# Altium schematic sheet PCB_Altium.schdoc
size 308 x 185 mm
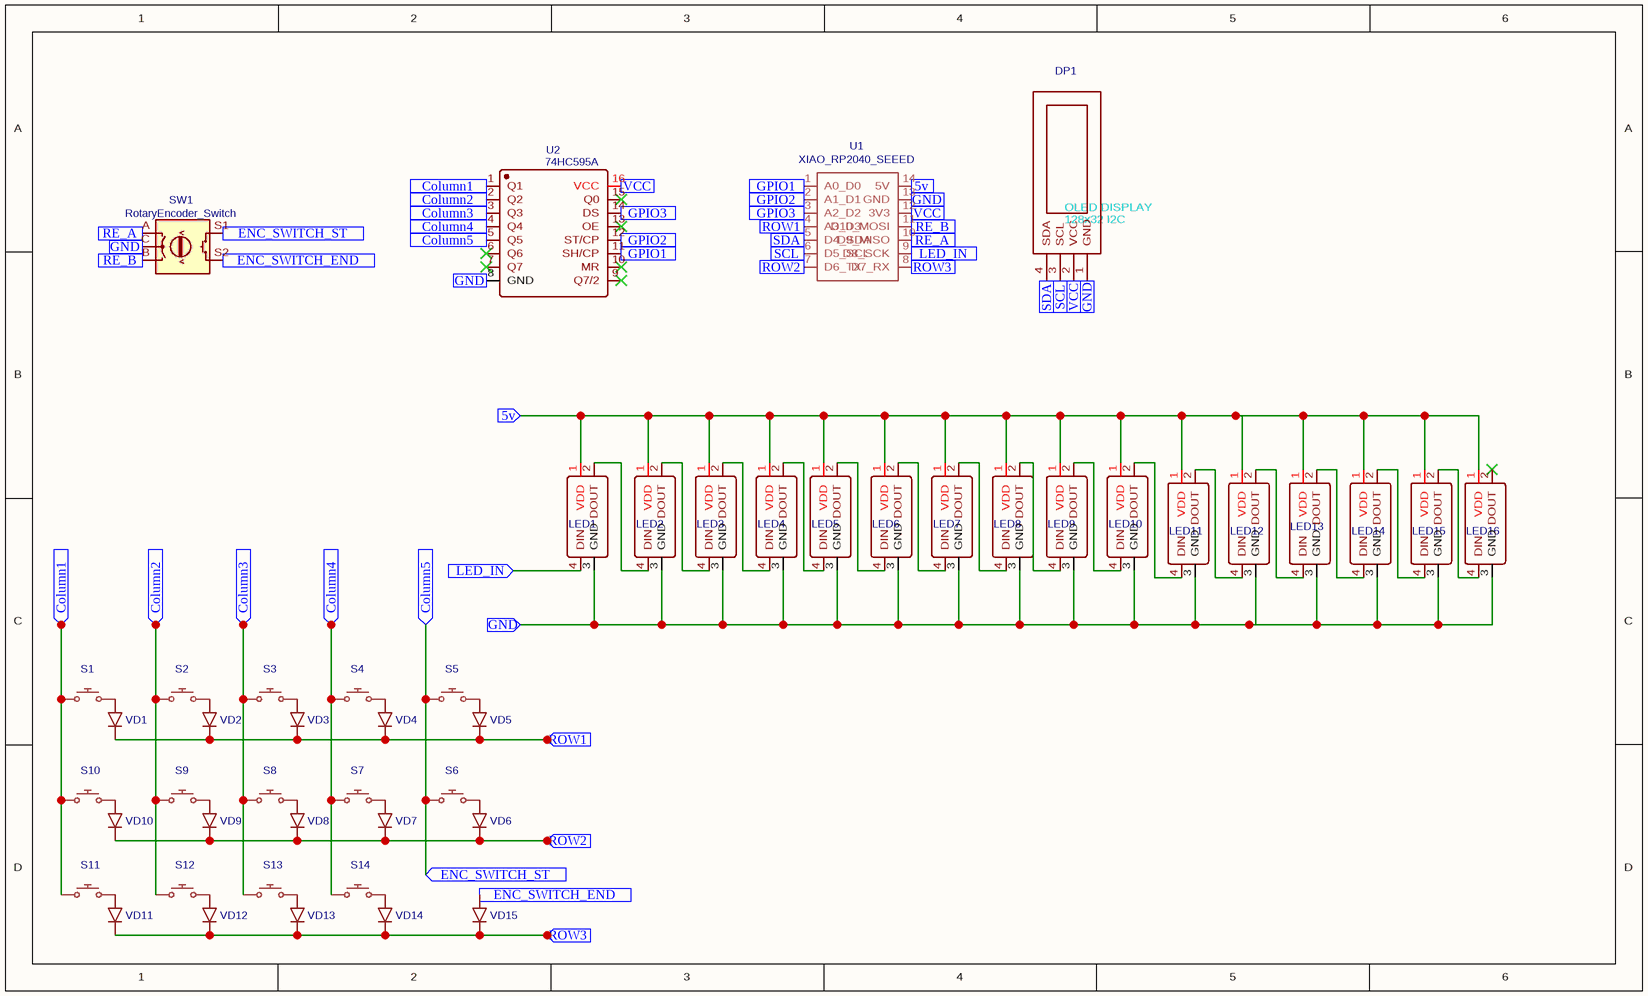
[diagram p0: PCB_Altium.schdoc]

## Parts
DP1  OLED DISPLAY 128x32 0.91" I2C SSD1306 STAG5  [4PIN-CONNECTION]  (value not drawn)
LED1  SK6812MINI-EA  [LED-SMD_4P-L3.2-W2.8_SK6812MINI-EA]  (value not drawn)
LED2  SK6812MINI-EA  [LED-SMD_4P-L3.2-W2.8_SK6812MINI-EA]  (value not drawn)
LED3  SK6812MINI-EA  [LED-SMD_4P-L3.2-W2.8_SK6812MINI-EA]  (value not drawn)
LED4  SK6812MINI-EA  [LED-SMD_4P-L3.2-W2.8_SK6812MINI-EA]  (value not drawn)
LED5  SK6812MINI-EA  [LED-SMD_4P-L3.2-W2.8_SK6812MINI-EA]  (value not drawn)
LED6  SK6812MINI-EA  [LED-SMD_4P-L3.2-W2.8_SK6812MINI-EA]  (value not drawn)
LED7  SK6812MINI-EA  [LED-SMD_4P-L3.2-W2.8_SK6812MINI-EA]  (value not drawn)
LED8  SK6812MINI-EA  [LED-SMD_4P-L3.2-W2.8_SK6812MINI-EA]  (value not drawn)
LED9  SK6812MINI-EA  [LED-SMD_4P-L3.2-W2.8_SK6812MINI-EA]  (value not drawn)
LED10  SK6812MINI-EA  [LED-SMD_4P-L3.2-W2.8_SK6812MINI-EA]  (value not drawn)
LED11  SK6812MINI-EA  [LED-SMD_4P-L3.2-W2.8_SK6812MINI-EA]  (value not drawn)
LED12  SK6812MINI-EA  [LED-SMD_4P-L3.2-W2.8_SK6812MINI-EA]  (value not drawn)
LED13  SK6812MINI-EA  [LED-SMD_4P-L3.2-W2.8_SK6812MINI-EA]  (value not drawn)
LED14  SK6812MINI-EA  [LED-SMD_4P-L3.2-W2.8_SK6812MINI-EA]  (value not drawn)
LED15  SK6812MINI-EA  [LED-SMD_4P-L3.2-W2.8_SK6812MINI-EA]  (value not drawn)
LED16  SK6812MINI-EA  [LED-SMD_4P-L3.2-W2.8_SK6812MINI-EA]  (value not drawn)
S1  CHERRY_CHERRY_MX  [CHERRY_MX]  (value not drawn)
S2  CHERRY_CHERRY_MX  [CHERRY_MX]  (value not drawn)
S3  CHERRY_CHERRY_MX  [CHERRY_MX]  (value not drawn)
S4  CHERRY_CHERRY_MX  [CHERRY_MX]  (value not drawn)
S5  CHERRY_CHERRY_MX  [CHERRY_MX]  (value not drawn)
S6  CHERRY_CHERRY_MX  [CHERRY_MX]  (value not drawn)
S7  CHERRY_CHERRY_MX  [CHERRY_MX]  (value not drawn)
S8  CHERRY_CHERRY_MX  [CHERRY_MX]  (value not drawn)
S9  CHERRY_CHERRY_MX  [CHERRY_MX]  (value not drawn)
S10  CHERRY_CHERRY_MX  [CHERRY_MX]  (value not drawn)
S11  CHERRY_CHERRY_MX  [CHERRY_MX]  (value not drawn)
S12  CHERRY_CHERRY_MX  [CHERRY_MX]  (value not drawn)
S13  CHERRY_CHERRY_MX  [CHERRY_MX]  (value not drawn)
S14  CHERRY_CHERRY_MX  [CHERRY_MX]  (value not drawn)
SW1  RotaryEncoder_Switch  [ROTARYENCODER_ALPS_EC11E-SWITCH_VERTICAL_H20MM]
U1  XIAO_RP2040_SEEED  [XIAO_RP2040_SEEED]
U2  74HC595A  [74HC595]
VD1  1N4148  [1N4148_1N4148W]  (value not drawn)
VD2  1N4148  [1N4148_1N4148W]  (value not drawn)
VD3  1N4148  [1N4148_1N4148W]  (value not drawn)
VD4  1N4148  [1N4148_1N4148W]  (value not drawn)
VD5  1N4148  [1N4148_1N4148W]  (value not drawn)
VD6  1N4148  [1N4148_1N4148W]  (value not drawn)
VD7  1N4148  [1N4148_1N4148W]  (value not drawn)
VD8  1N4148  [1N4148_1N4148W]  (value not drawn)
VD9  1N4148  [1N4148_1N4148W]  (value not drawn)
VD10  1N4148  [1N4148_1N4148W]  (value not drawn)
VD11  1N4148  [1N4148_1N4148W]  (value not drawn)
VD12  1N4148  [1N4148_1N4148W]  (value not drawn)
VD13  1N4148  [1N4148_1N4148W]  (value not drawn)
VD14  1N4148  [1N4148_1N4148W]  (value not drawn)
VD15  1N4148  [1N4148_1N4148W]  (value not drawn)

## Ports
5v (in), Column1 (in), Column2 (in), Column3 (in), Column4 (in), Column5 (in), ENC_SWITCH_END (in), ENC_SWITCH_ST (in), GND (in), GPIO1 (in), GPIO2 (in), GPIO3 (in), LED_IN (in), RE_A (in), RE_B (in), ROW1 (in), ROW2 (in), ROW3 (in), SCL (in), SDA (in), VCC (in)

## Nets
5v: LED1.1(VDD) LED2.1(VDD) LED3.1(VDD) LED4.1(VDD) LED5.1(VDD) LED6.1(VDD) LED7.1(VDD) LED8.1(VDD) LED9.1(VDD) LED10.1(VDD) LED11.1(VDD) LED12.1(VDD) LED13.1(VDD) LED14.1(VDD) LED15.1(VDD) LED16.1(VDD) U1.14(5V) ; port 5v
Column1: S1.S1 S10.S1 S11.S1 U2.1(Q1) ; port Column1
Column2: S2.S1 S9.S1 S12.S1 U2.2(Q2) ; port Column2
Column3: S3.S1 S8.S1 S13.S1 U2.3(Q3) ; port Column3
Column4: S4.S1 S7.S1 S14.S1 U2.4(Q4) ; port Column4
Column5: S5.S1 S6.S1 SW1.S1 U2.5(Q5) ; port ENC_SWITCH_ST, port Column5
ENC_SWITCH_END: SW1.S2 VD15.2 ; port ENC_SWITCH_END
GND: DP1.1(GND) LED1.3(GND) LED2.3(GND) LED3.3(GND) LED4.3(GND) LED5.3(GND) LED6.3(GND) LED7.3(GND) LED8.3(GND) LED9.3(GND) LED10.3(GND) LED11.3(GND) LED12.3(GND) LED13.3(GND) LED14.3(GND) LED15.3(GND) LED16.3(GND) SW1.C U1.13(GND) U2.8(GND) ; port GND
GPIO1: U1.1(A0_D0) U2.11(SH/CP) ; port GPIO1
GPIO2: U1.2(A1_D1) U2.12(ST/CP) ; port GPIO2
GPIO3: U1.3(A2_D2) U2.14(DS) ; port GPIO3
LED_IN: LED1.4(DIN) U1.9(D8_SCK) ; port LED_IN
RE_A: SW1.A U1.10(D9_MISO) ; port RE_A
RE_B: SW1.B U1.11(D10_MOSI) ; port RE_B
ROW1: U1.4(A3_D3) VD1.1 VD2.1 VD3.1 VD4.1 VD5.1 ; port ROW1
ROW2: U1.7(D6_TX) VD6.1 VD7.1 VD8.1 VD9.1 VD10.1 ; port ROW2
ROW3: U1.8(D7_RX) VD11.1 VD12.1 VD13.1 VD14.1 VD15.1 ; port ROW3
SCL: DP1.3(SCL) U1.6(D5_SCL) ; port SCL
SDA: DP1.4(SDA) U1.5(D4_SDA) ; port SDA
VCC: DP1.2(VCC) U1.12(3V3) U2.16(VCC) ; port VCC
NetLED1_2: LED1.2(DOUT) LED2.4(DIN)
NetLED2_2: LED2.2(DOUT) LED3.4(DIN)
NetLED3_2: LED3.2(DOUT) LED4.4(DIN)
NetLED4_2: LED4.2(DOUT) LED5.4(DIN)
NetLED5_2: LED5.2(DOUT) LED6.4(DIN)
NetLED6_2: LED6.2(DOUT) LED7.4(DIN)
NetLED7_2: LED7.2(DOUT) LED8.4(DIN)
NetLED8_2: LED8.2(DOUT) LED9.4(DIN)
NetLED9_2: LED9.2(DOUT) LED10.4(DIN)
NetLED10_2: LED10.2(DOUT) LED11.4(DIN)
NetLED11_2: LED11.2(DOUT) LED12.4(DIN)
NetLED12_2: LED12.2(DOUT) LED13.4(DIN)
NetLED13_2: LED13.2(DOUT) LED14.4(DIN)
NetLED14_2: LED14.2(DOUT) LED15.4(DIN)
NetLED15_2: LED15.2(DOUT) LED16.4(DIN)
NetS1_S2: S1.S2 VD1.2
NetS2_S2: S2.S2 VD2.2
NetS3_S2: S3.S2 VD3.2
NetS4_S2: S4.S2 VD4.2
NetS5_S2: S5.S2 VD5.2
NetS6_S2: S6.S2 VD6.2
NetS7_S2: S7.S2 VD7.2
NetS8_S2: S8.S2 VD8.2
NetS9_S2: S9.S2 VD9.2
NetS10_S2: S10.S2 VD10.2
NetS11_S2: S11.S2 VD11.2
NetS12_S2: S12.S2 VD12.2
NetS13_S2: S13.S2 VD13.2
NetS14_S2: S14.S2 VD14.2

Not connected (* = marked no-connect by the designer): LED16 2(DOUT)*; U2 6(Q6)* 7(Q7)* 9(Q7/2)* 10(MR)* 13(OE)* 15(Q0)*

## Notes on the sheet
- (near LED13) LED13
- (in symbol OLED DISPLAY 128x32 0.91" I2C SSD1306 STAG5) OLED DISPLAY / 128x32 I2C

## Library data of the parts
DP1 = OLED DISPLAY 128x32 0.91" I2C SSD1306 STAG5: Contributor: Saber T; spicePre: D; spiceSymbolName: OLED DISPLAY 128x32 0.91" I2C SSD1306 STAG5
LED1-LED16 = SK6812MINI-EA: Manufacturer: 欧思科光电; Contributor: lcsc; Supplier: LCSC; Supplier Part: C5378731; Manufacturer Part: SK6812MINI-EA; JLCPCB Part Class: Extended Part; spicePre: L; spiceSymbolName: SK6812MINI-EA
S1-S14 = CHERRY_CHERRY_MX: Contributor: paillechat; Package Display: No; spicePre: S; spiceSymbolName: CHERRY_CHERRY_MX
SW1 = RotaryEncoder_Switch: Contributor: chris1414; Footprint: Rotary_Encoder:RotaryEncoder_Alps_EC11E-Switch_Vertical_H20mm; spicePre: S; spiceSymbolName: RotaryEncoder_Switch
U1 = XIAO_RP2040_SEEED: Contributor: jeen; spicePre: U; spiceSymbolName: XIAO_RP2040_SEEED
U2 = 74HC595A: Manufacturer: FM; Contributor: ackw; Supplier Part: C110383; Supplier: LCSC; Manufacturer Part: 74HC595A; spicePre: U; spiceSymbolName: 74HC595A
VD1-VD15 = 1N4148: Contributor: shelfman; Package Display: No; spicePre: D; spiceSymbolName: 1N4148